# EAGLE design UltrasonicSensorArray (EAGLE 9.5.2)
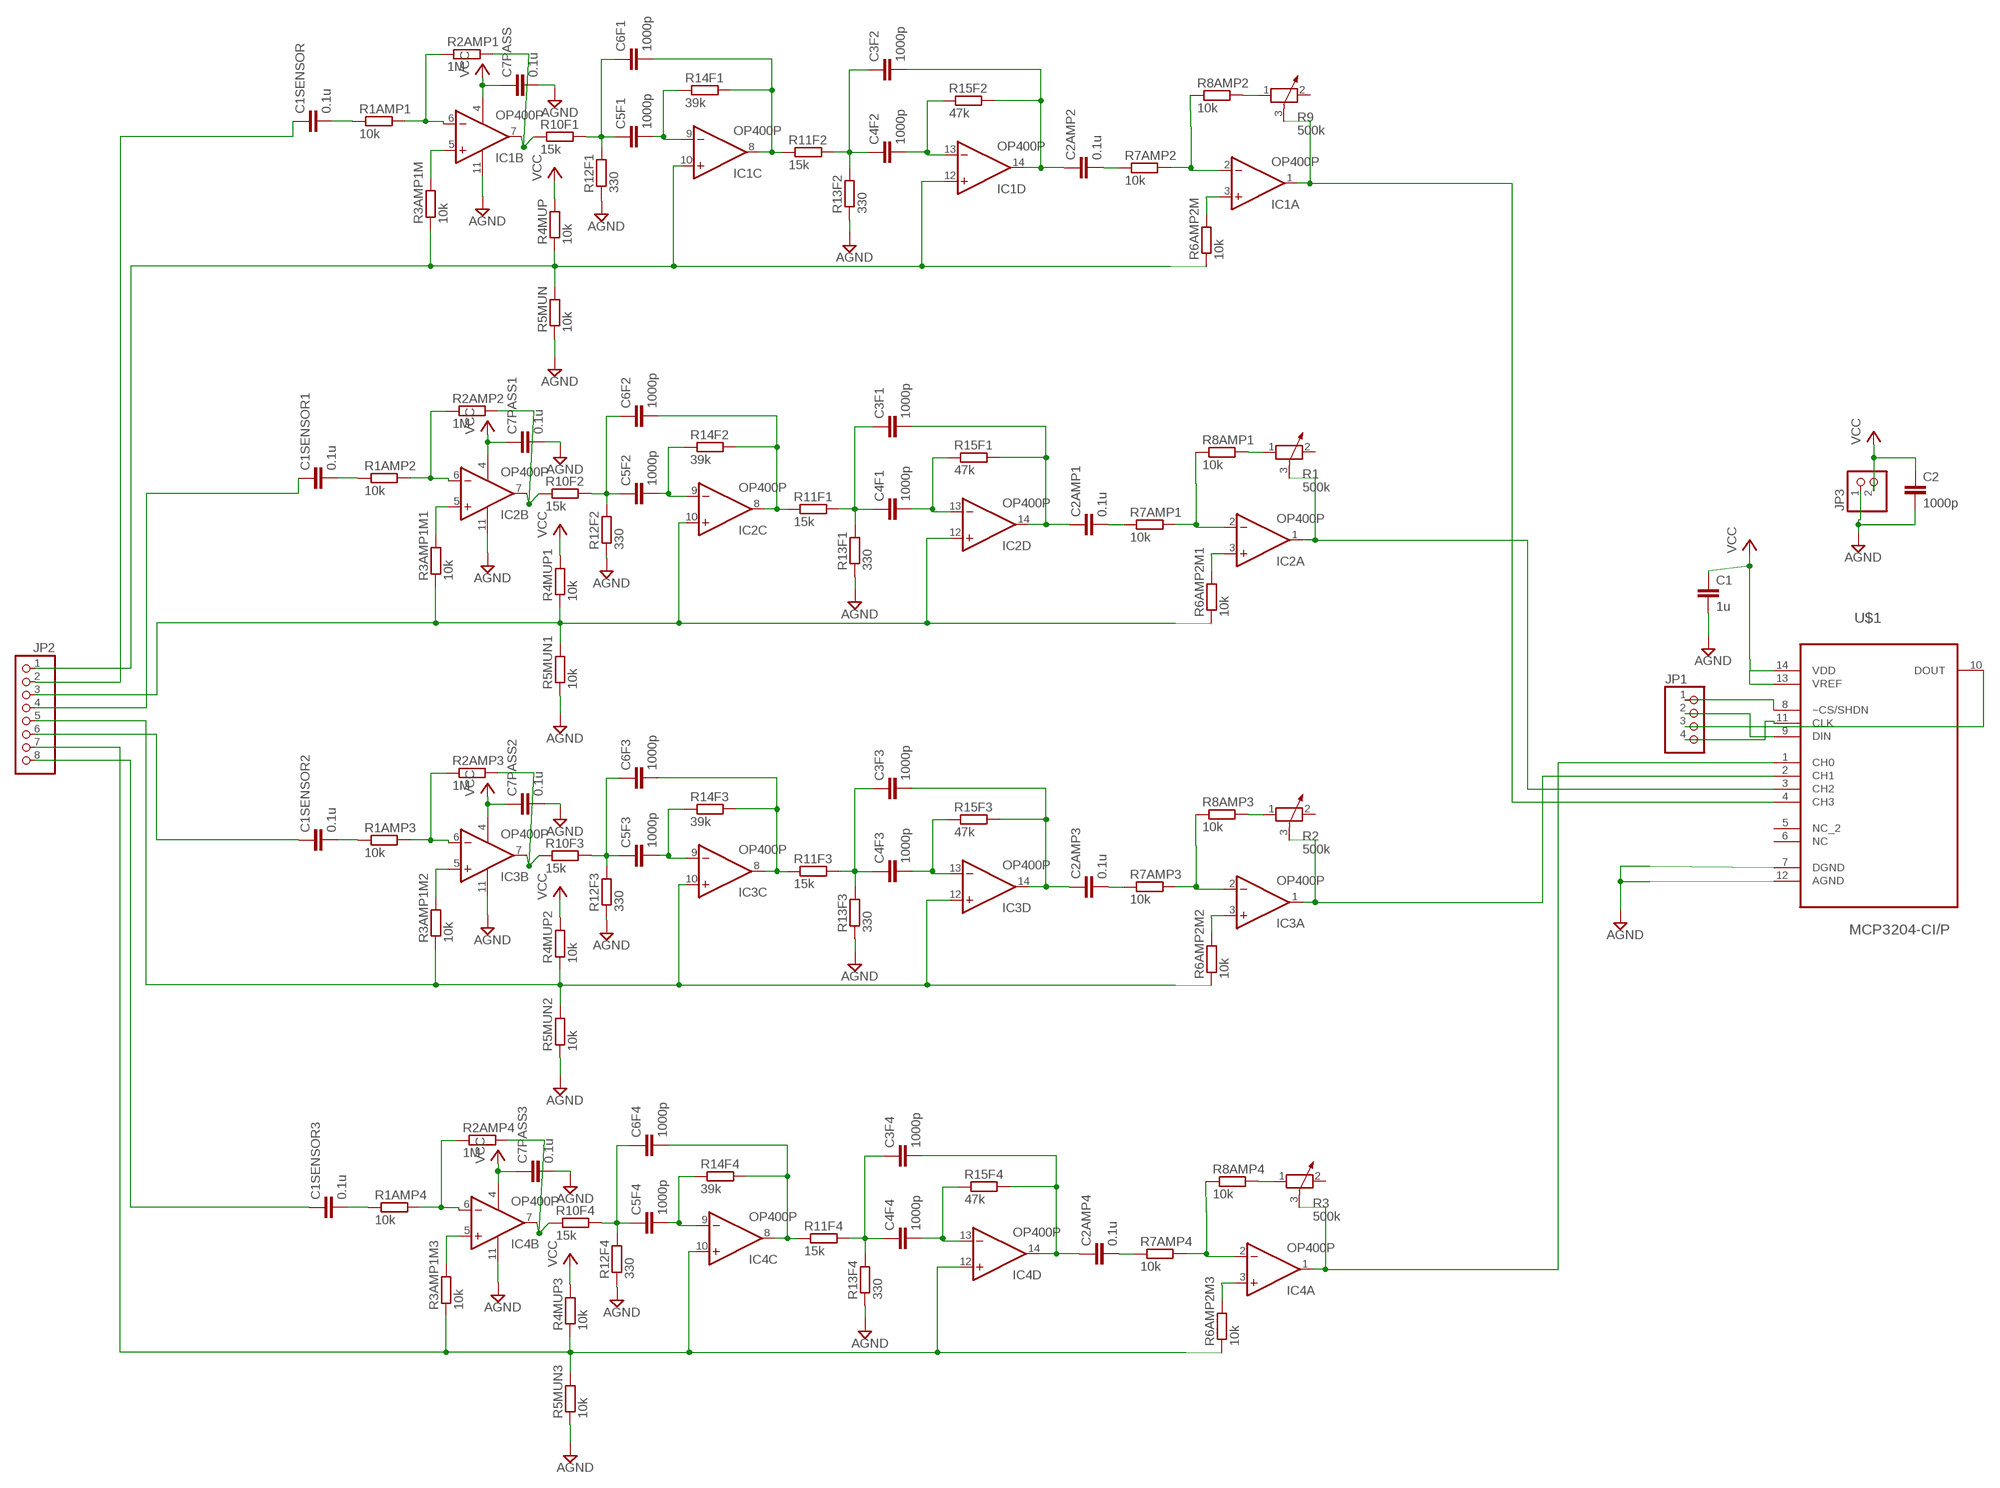
[diagram p0: schematic, sheet 1]

## Parts
C1  1u  C-EUC0603K  [C0603K]
C1SENSOR  0.1u  C-EUC0603K  [C0603K]
C1SENSOR1  0.1u  C-EUC0603K  [C0603K]
C1SENSOR2  0.1u  C-EUC0603K  [C0603K]
C1SENSOR3  0.1u  C-EUC0603K  [C0603K]
C2  1000p  C-EUC0603K  [C0603K]
C2AMP1  0.1u  C-EUC0603K  [C0603K]
C2AMP2  0.1u  C-EUC0603K  [C0603K]
C2AMP3  0.1u  C-EUC0603K  [C0603K]
C2AMP4  0.1u  C-EUC0603K  [C0603K]
C3F1  1000p  C-EUC0603K  [C0603K]
C3F2  1000p  C-EUC0603K  [C0603K]
C3F3  1000p  C-EUC0603K  [C0603K]
C3F4  1000p  C-EUC0603K  [C0603K]
C4F1  1000p  C-EUC0603K  [C0603K]
C4F2  1000p  C-EUC0603K  [C0603K]
C4F3  1000p  C-EUC0603K  [C0603K]
C4F4  1000p  C-EUC0603K  [C0603K]
C5F1  1000p  C-EUC0603K  [C0603K]
C5F2  1000p  C-EUC0603K  [C0603K]
C5F3  1000p  C-EUC0603K  [C0603K]
C5F4  1000p  C-EUC0603K  [C0603K]
C6F1  1000p  C-EUC0603K  [C0603K]
C6F2  1000p  C-EUC0603K  [C0603K]
C6F3  1000p  C-EUC0603K  [C0603K]
C6F4  1000p  C-EUC0603K  [C0603K]
C7PASS  0.1u  C-EUC0603K  [C0603K]
C7PASS1  0.1u  C-EUC0603K  [C0603K]
C7PASS2  0.1u  C-EUC0603K  [C0603K]
C7PASS3  0.1u  C-EUC0603K  [C0603K]
IC1  OP400P  [DIL14]
IC2  OP400P  [DIL14]
IC3  OP400P  [DIL14]
IC4  OP400P  [DIL14]
JP1  PINHD-1X4  [1X04]
JP2  PINHD-1X8  [1X08]
JP3  PINHD-1X2  [1X02]
R1  500k  POTENTIOMETER_PT-10  [PT-10]
R1AMP1  10k  R-EU_R0603  [R0603]
R1AMP2  10k  R-EU_R0603  [R0603]
R1AMP3  10k  R-EU_R0603  [R0603]
R1AMP4  10k  R-EU_R0603  [R0603]
R2  500k  POTENTIOMETER_PT-10  [PT-10]
R2AMP1  1M  R-EU_R0603  [R0603]
R2AMP2  1M  R-EU_R0603  [R0603]
R2AMP3  1M  R-EU_R0603  [R0603]
R2AMP4  1M  R-EU_R0603  [R0603]
R3  500k  POTENTIOMETER_PT-10  [PT-10]
R3AMP1M  10k  R-EU_R0603  [R0603]
R3AMP1M1  10k  R-EU_R0603  [R0603]
R3AMP1M2  10k  R-EU_R0603  [R0603]
R3AMP1M3  10k  R-EU_R0603  [R0603]
R4MUP  10k  R-EU_R0603  [R0603]
R4MUP1  10k  R-EU_R0603  [R0603]
R4MUP2  10k  R-EU_R0603  [R0603]
R4MUP3  10k  R-EU_R0603  [R0603]
R5MUN  10k  R-EU_R0603  [R0603]
R5MUN1  10k  R-EU_R0603  [R0603]
R5MUN2  10k  R-EU_R0603  [R0603]
R5MUN3  10k  R-EU_R0603  [R0603]
R6AMP2M  10k  R-EU_R0603  [R0603]
R6AMP2M1  10k  R-EU_R0603  [R0603]
R6AMP2M2  10k  R-EU_R0603  [R0603]
R6AMP2M3  10k  R-EU_R0603  [R0603]
R7AMP1  10k  R-EU_R0603  [R0603]
R7AMP2  10k  R-EU_R0603  [R0603]
R7AMP3  10k  R-EU_R0603  [R0603]
R7AMP4  10k  R-EU_R0603  [R0603]
R8AMP1  10k  R-EU_R0603  [R0603]
R8AMP2  10k  R-EU_R0603  [R0603]
R8AMP3  10k  R-EU_R0603  [R0603]
R8AMP4  10k  R-EU_R0603  [R0603]
R9  500k  POTENTIOMETER_PT-10  [PT-10]
R10F1  15k  R-EU_R0603  [R0603]
R10F2  15k  R-EU_R0603  [R0603]
R10F3  15k  R-EU_R0603  [R0603]
R10F4  15k  R-EU_R0603  [R0603]
R11F1  15k  R-EU_R0603  [R0603]
R11F2  15k  R-EU_R0603  [R0603]
R11F3  15k  R-EU_R0603  [R0603]
R11F4  15k  R-EU_R0603  [R0603]
R12F1  330  R-EU_R0603  [R0603]
R12F2  330  R-EU_R0603  [R0603]
R12F3  330  R-EU_R0603  [R0603]
R12F4  330  R-EU_R0603  [R0603]
R13F1  330  R-EU_R0603  [R0603]
R13F2  330  R-EU_R0603  [R0603]
R13F3  330  R-EU_R0603  [R0603]
R13F4  330  R-EU_R0603  [R0603]
R14F1  39k  R-EU_0207/7  [0207/7]
R14F2  39k  R-EU_0207/7  [0207/7]
R14F3  39k  R-EU_0207/7  [0207/7]
R14F4  39k  R-EU_0207/7  [0207/7]
R15F1  47k  R-EU_0207/7  [0207/7]
R15F2  47k  R-EU_0207/7  [0207/7]
R15F3  47k  R-EU_0207/7  [0207/7]
R15F4  47k  R-EU_0207/7  [0207/7]
U$1  MCP3204-CI/P  [DIP254P762X432-14]

## Nets
AGND [power]: C1.2 C2.2 C7PASS1.2 C7PASS2.2 C7PASS3.2 C7PASS.2 IC1.11(P:V-) IC2.11(P:V-) IC3.11(P:V-) IC4.11(P:V-) JP3.1 R5MUN1.1 R5MUN2.1 R5MUN3.1 R5MUN.1 R12F1.1 R12F2.1 R12F3.1 R12F4.1 R13F1.1 R13F2.1 R13F3.1 R13F4.1 U$1.7(DGND) U$1.12(AGND)
N$1: IC1.6(B:-IN) R1AMP1.2 R2AMP1.1
N$2: IC1.5(B:+IN) R3AMP1M.2
N$3: IC1.7(B:OUT) R2AMP1.2 R10F1.1
N$4: IC1.2(A:-IN) R7AMP2.2 R8AMP2.1
N$5: IC1.10(C:+IN) IC1.12(D:+IN) JP2.1 R3AMP1M.1 R4MUP.1 R5MUN.2 R6AMP2M.1
N$6: C1SENSOR.1 JP2.2
N$7: IC1.3(A:+IN) R6AMP2M.2
N$8: C1SENSOR.2 R1AMP1.1
N$9: C2AMP2.2 R7AMP2.1
N$10: R8AMP2.2 R9.1
N$11: IC1.1(A:OUT) R9.3 U$1.4(CH3)
N$12: C2AMP2.1 C3F2.2 IC1.14(D:OUT) R15F2.2
N$13: C5F1.2 IC1.9(C:-IN) R14F1.1
N$14: C4F2.2 IC1.13(D:-IN) R15F2.1
N$15: C3F2.1 C4F2.1 R11F2.2 R13F2.2
N$16: C6F1.2 IC1.8(C:OUT) R11F2.1 R14F1.2
N$17: C5F1.1 C6F1.1 R10F1.2 R12F1.2
N$18: IC2.6(B:-IN) R1AMP2.2 R2AMP2.1
N$19: IC2.7(B:OUT) R2AMP2.2 R10F2.1
N$20: IC2.10(C:+IN) IC2.12(D:+IN) JP2.3 R3AMP1M1.1 R4MUP1.1 R5MUN1.2 R6AMP2M1.1
N$21: IC2.2(A:-IN) R7AMP1.2 R8AMP1.1
N$22: IC2.3(A:+IN) R6AMP2M1.2
N$23: C1SENSOR1.2 R1AMP2.1
N$24: C2AMP1.2 R7AMP1.1
N$25: R1.1 R8AMP1.2
N$26: C2AMP1.1 C3F1.2 IC2.14(D:OUT) R15F1.2
N$27: C5F2.2 IC2.9(C:-IN) R14F2.1
N$28: C4F1.2 IC2.13(D:-IN) R15F1.1
N$29: C3F1.1 C4F1.1 R11F1.2 R13F1.2
N$30: C6F2.2 IC2.8(C:OUT) R11F1.1 R14F2.2
N$31: C5F2.1 C6F2.1 R10F2.2 R12F2.2
N$32: IC2.5(B:+IN) R3AMP1M1.2
N$33: C1SENSOR1.1 JP2.4
N$34: IC2.1(A:OUT) R1.3 U$1.3(CH2)
N$35: IC3.6(B:-IN) R1AMP3.2 R2AMP3.1
N$36: IC3.7(B:OUT) R2AMP3.2 R10F3.1
N$37: IC3.10(C:+IN) IC3.12(D:+IN) JP2.5 R3AMP1M2.1 R4MUP2.1 R5MUN2.2 R6AMP2M2.1
N$38: IC3.2(A:-IN) R7AMP3.2 R8AMP3.1
N$39: IC3.3(A:+IN) R6AMP2M2.2
N$40: C1SENSOR2.2 R1AMP3.1
N$41: C2AMP3.2 R7AMP3.1
N$42: R2.1 R8AMP3.2
N$43: C2AMP3.1 C3F3.2 IC3.14(D:OUT) R15F3.2
N$44: C5F3.2 IC3.9(C:-IN) R14F3.1
N$45: C4F3.2 IC3.13(D:-IN) R15F3.1
N$46: C3F3.1 C4F3.1 R11F3.2 R13F3.2
N$47: C6F3.2 IC3.8(C:OUT) R11F3.1 R14F3.2
N$48: C5F3.1 C6F3.1 R10F3.2 R12F3.2
N$49: IC3.5(B:+IN) R3AMP1M2.2
N$50: C1SENSOR2.1 JP2.6
N$51: IC3.1(A:OUT) R2.3 U$1.2(CH1)
N$52: IC4.6(B:-IN) R1AMP4.2 R2AMP4.1
N$53: IC4.7(B:OUT) R2AMP4.2 R10F4.1
N$54: IC4.10(C:+IN) IC4.12(D:+IN) JP2.7 R3AMP1M3.1 R4MUP3.1 R5MUN3.2 R6AMP2M3.1
N$55: IC4.2(A:-IN) R7AMP4.2 R8AMP4.1
N$56: IC4.3(A:+IN) R6AMP2M3.2
N$57: C1SENSOR3.2 R1AMP4.1
N$58: C2AMP4.2 R7AMP4.1
N$59: R3.1 R8AMP4.2
N$60: C2AMP4.1 C3F4.2 IC4.14(D:OUT) R15F4.2
N$61: C5F4.2 IC4.9(C:-IN) R14F4.1
N$62: C4F4.2 IC4.13(D:-IN) R15F4.1
N$63: C3F4.1 C4F4.1 R11F4.2 R13F4.2
N$64: C6F4.2 IC4.8(C:OUT) R11F4.1 R14F4.2
N$65: C5F4.1 C6F4.1 R10F4.2 R12F4.2
N$66: IC4.5(B:+IN) R3AMP1M3.2
N$67: C1SENSOR3.1 JP2.8
N$68: IC4.1(A:OUT) R3.3 U$1.1(CH0)
N$69: JP1.1 U$1.8(~CS/SHDN)
N$70: JP1.2 U$1.9(DIN)
N$71: JP1.4 U$1.11(CLK)
N$72: JP1.3 U$1.10(DOUT)
VCC [power]: C1.1 C2.1 C7PASS1.1 C7PASS2.1 C7PASS3.1 C7PASS.1 IC1.4(P:V+) IC2.4(P:V+) IC3.4(P:V+) IC4.4(P:V+) JP3.2 R4MUP1.2 R4MUP2.2 R4MUP3.2 R4MUP.2 U$1.13(VREF) U$1.14(VDD)
Unconnected: R1.2 R2.2 R3.2 R9.2 U$1.5(NC_2) U$1.6(NC)

## Library data of the parts
C1 C1SENSOR C1SENSOR1-C1SENSOR3 C2 C2AMP1-C2AMP4 C3F1-C3F4 C4F1-C4F4 C5F1-C5F4 C6F1-C6F4 C7PASS C7PASS1-C7PASS3 = rcl:C-EU: CAPACITOR, European symbol; SPICEPREFIX: C
IC1-IC4 = linear:OP400: OP AMP
JP1 = pinhead:PINHD-1X4: PIN HEADER
JP2 = pinhead:PINHD-1X8: PIN HEADER
JP3 = pinhead:PINHD-1X2: PIN HEADER
R1-R3 R9 = rcl:POTENTIOMETER_: Potentiometer; SPICEMODEL: POT; SPICEPREFIX: X
R1AMP1-R1AMP4 R2AMP1-R2AMP4 R3AMP1M R3AMP1M1-R3AMP1M3 R4MUP R4MUP1-R4MUP3 R5MUN R5MUN1-R5MUN3 R6AMP2M R6AMP2M1-R6AMP2M3 R7AMP1-R7AMP4 R8AMP1-R8AMP4 R10F1-R10F4 R11F1-R11F4 R12F1-R12F4 R13F1-R13F4 R14F1-R14F4 R15F1-R15F4 = rcl:R-EU_: RESISTOR, European symbol; SPICEPREFIX: R
U$1 = MCP3204-CI_P:MCP3204-CI/P: A/D Converters; AVAILABILITY: Unavailable; DESCRIPTION: 12 Bit Analog to Digital Converter 2, 4 Input 1 SAR 14-PDIP; MF: Microchip; MP: MCP3204-CI/P; PACKAGE: DIP-14 Microchip; PRICE: None

## Net classes
0 default: width 0.61 mm, clearance 0.203 mm
1 power: width 0.914 mm, clearance 0.254 mm

## Board
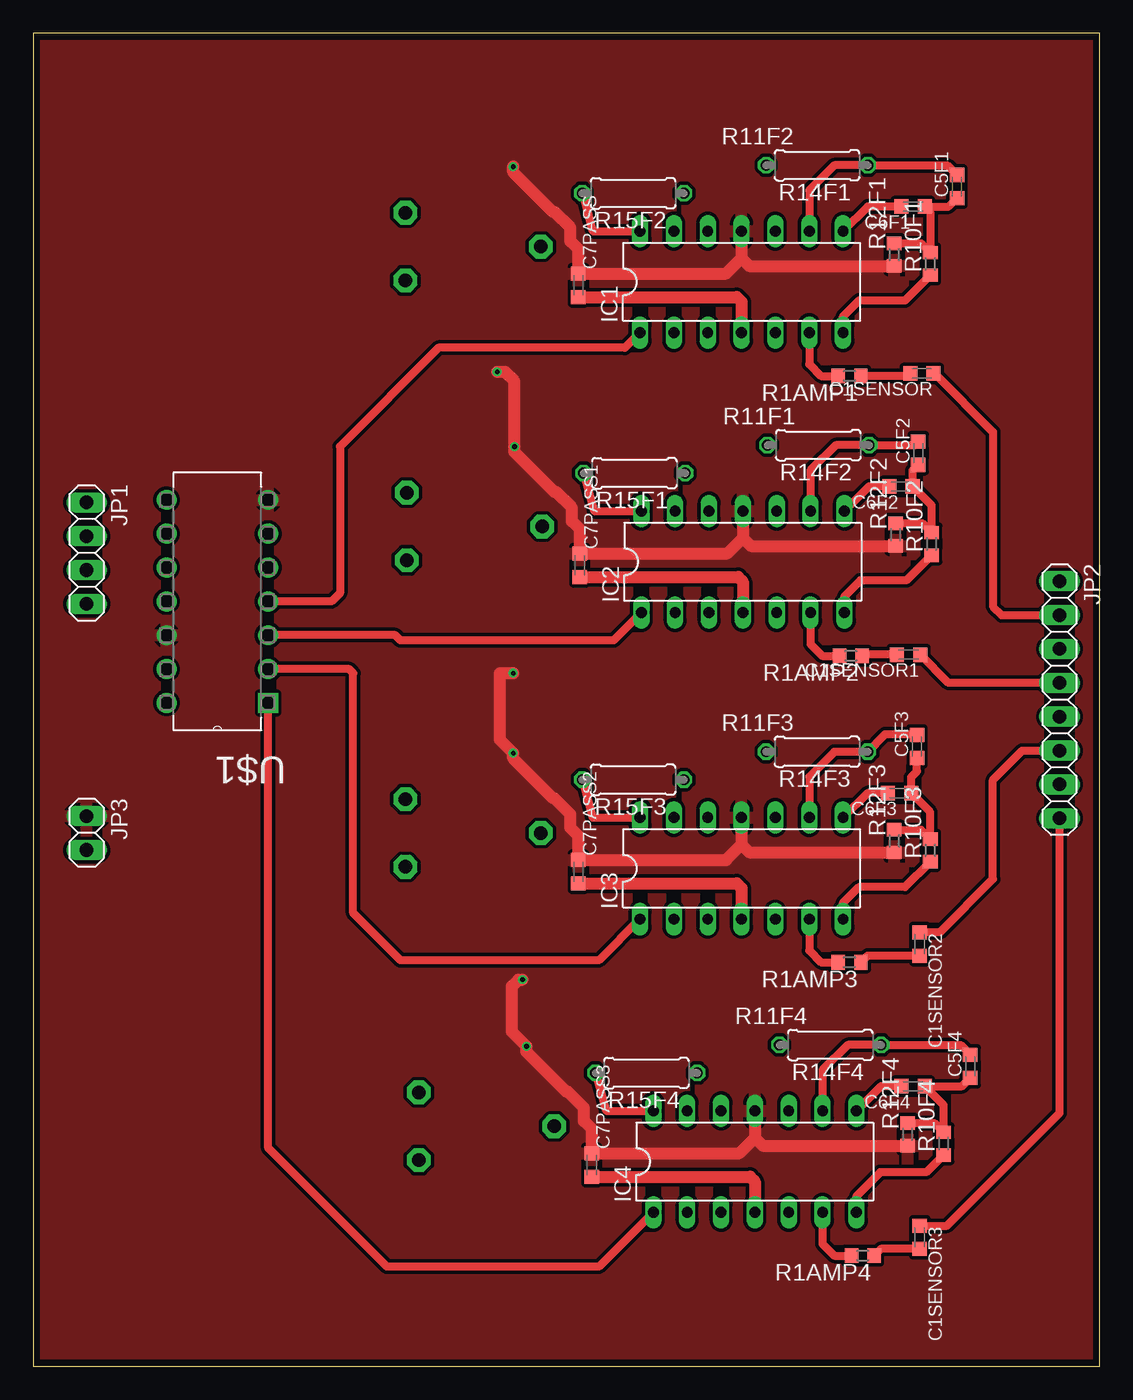
[diagram p1: board, top side]
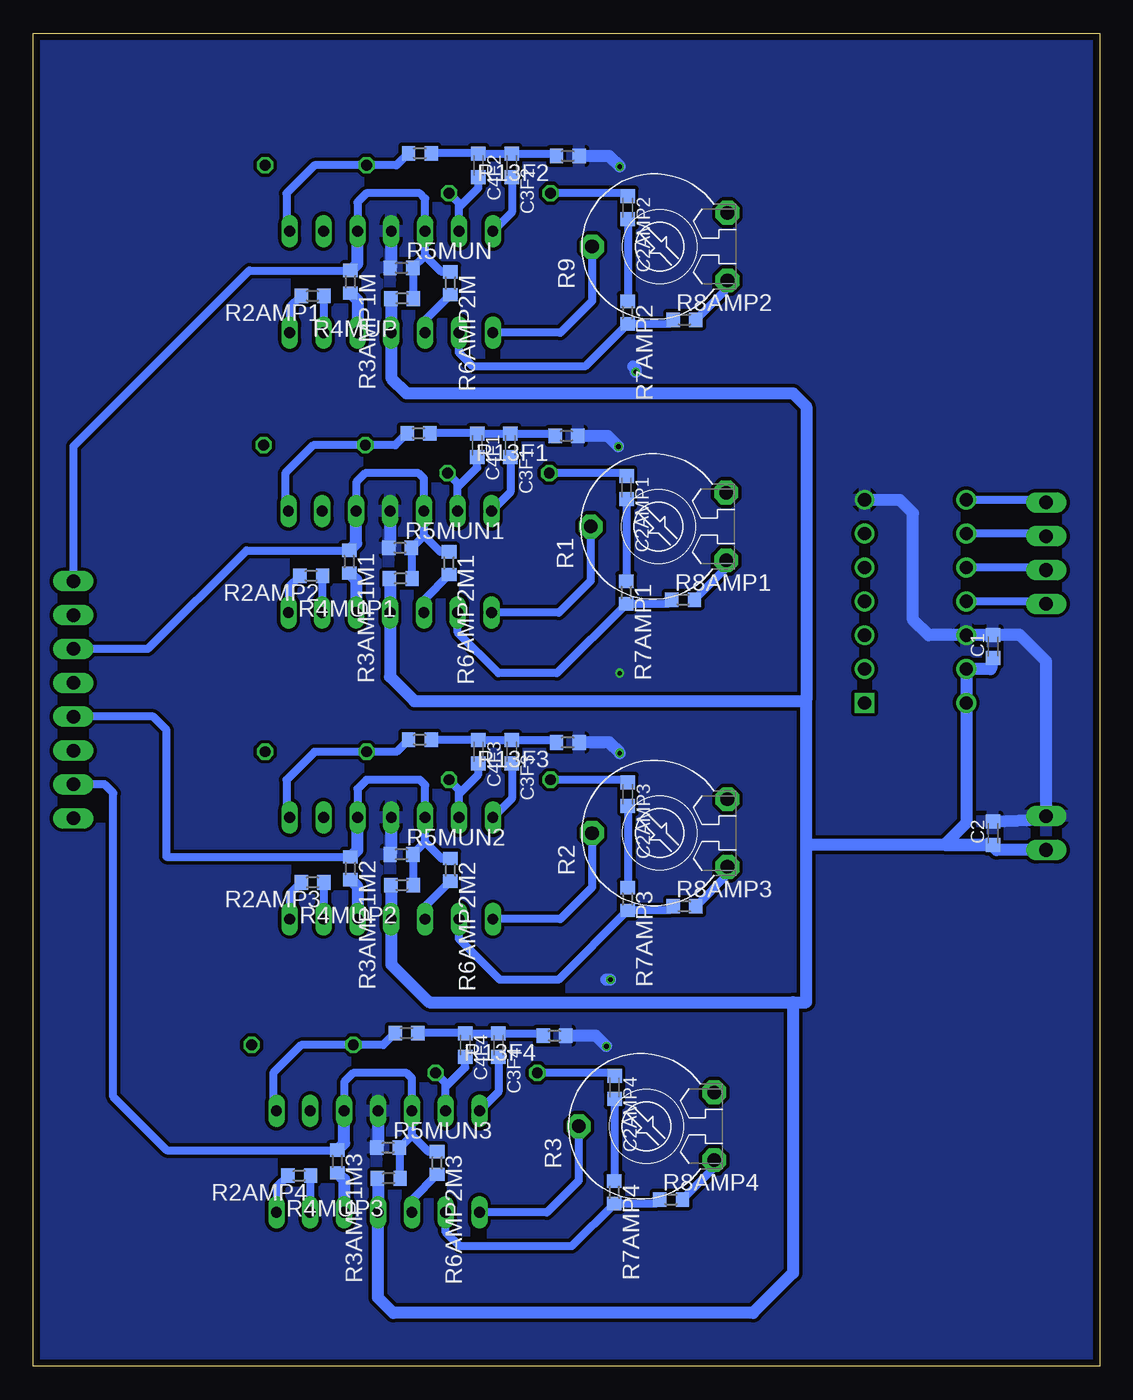
[diagram p2: board, bottom side, seen from below]

Size 80 x 100 mm. Coordinates in mm from the lower left corner, seen from the top.
Outline: 0,0 80,0 80,100 0,100 0,0
Copper layers (1*16): Top 0.035mm / dielectric 1.6mm / Bottom 0.035mm
Design rules "Elecrow_2-layer_PCB_eagle_rule": minimum track width 6mil, minimum drill 12mil, track to track 6mil, track to pad 6mil, pad to pad 6mil, via to via 8mil, smd to smd 0mil, copper to edge 20mil, drill to drill 10mil, minimum pad ring 6mil, minimum via ring 6mil, stop-mask expansion 0mil, vias tented up to drill 100mil, thermal gap 10mil

### Footprints (pad centres in the part's own frame; a part is rotated, then mirrored left to right if it is on the bottom)
C0603K = smd 1.05 x 1.08: 1 -0.875,0; 2 0.875,0
DIL14 = drill 0.813 long: 1 -7.62,-3.81; 2 -5.08,-3.81; 3 -2.54,-3.81; 4 0,-3.81; 5 2.54,-3.81; 6 5.08,-3.81; 7 7.62,-3.81; 8 7.62,3.81; 9 5.08,3.81; 10 2.54,3.81; 11 0,3.81; 12 -2.54,3.81; 13 -5.08,3.81; 14 -7.62,3.81
1X04 = drill 1.016 long: 1 -3.81,0; 2 -1.27,0; 3 1.27,0; 4 3.81,0
1X08 = drill 1.016 long: 1 -8.89,0; 2 -6.35,0; 3 -3.81,0; 4 -1.27,0; 5 1.27,0; 6 3.81,0; 7 6.35,0; 8 8.89,0
1X02 = drill 1.016 long: 1 -1.27,0; 2 1.27,0
PT-10 = drill 1.016 pad 1.778 octagon: 1 -2.54,-5.08; 2 2.54,-5.08; 3 0,5.08
R0603 = smd 1 x 1.1: 1 -0.85,0; 2 0.85,0
0207/7 = drill 0.813 octagon: 1 -3.81,0; 2 3.81,0
DIP254P762X432-14 = drill 0.991 square: 1 -7.62,15.24 | drill 0.991: 2 -7.62,12.7; 3 -7.62,10.16; 4 -7.62,7.62; 5 -7.62,5.08; 6 -7.62,2.54; 7 -7.62,0; 8 0,0; 9 0,2.54; 10 0,5.08; 11 0,7.62; 12 0,10.16; 13 0,12.7; 14 0,15.24

### Placement (x,y rotation side)
C1  8,54 90 bottom
C1SENSOR  66.67,74.49 180 top
C1SENSOR1  65.67,53.39 180 top
C1SENSOR2  66.51,31.67 270 top
C1SENSOR3  66.51,9.67 270 top
C2  8,40 90 bottom
C2AMP1  35.49,65.92 270 bottom
C2AMP2  35.39,86.92 270 bottom
C2AMP3  35.39,42.92 270 bottom
C2AMP4  36.39,20.92 270 bottom
C3F1  44.2,69.1 270 bottom
C3F2  44.1,90.1 270 bottom
C3F3  44.1,46.1 270 bottom
C3F4  45.1,24.1 270 bottom
C4F1  46.7,69.1 270 bottom
C4F2  46.6,90.1 270 bottom
C4F3  46.6,46.1 270 bottom
C4F4  47.6,24.1 270 bottom
C5F1  69.3,88.5 90 top
C5F2  66.4,68.5 90 top
C5F3  66.3,46.5 90 top
C5F4  70.3,22.5 90 top
C6F1  66,87 180 top
C6F2  65.1,66 180 top
C6F3  65,43 180 top
C6F4  66,21 180 top
C7PASS  40.9,81.1 90 top
C7PASS1  41,60.1 90 top
C7PASS2  40.9,37.1 90 top
C7PASS3  41.9,15.1 90 top
IC1  53.14,81.35 0 top
IC2  53.24,60.35 0 top
IC3  53.14,37.35 0 top
IC4  54.14,15.35 0 top
JP1  4,61 270 top
JP2  77,50 270 top
JP3  4,40 270 top
R1  33.1,63 90 bottom
R1AMP1  61.24,74.3 180 top
R1AMP2  61.34,53.3 180 top
R1AMP3  61.24,30.3 180 top
R1AMP4  62.24,8.3 180 top
R2  33,40 90 bottom
R2AMP1  59.05,80.3 180 bottom
R2AMP2  59.15,59.3 180 bottom
R2AMP3  59.05,36.3 180 bottom
R2AMP4  60.05,14.3 180 bottom
R3  34,18 90 bottom
R3AMP1M  56.2,81.36 270 bottom
R3AMP1M1  56.3,60.36 270 bottom
R3AMP1M2  56.2,37.36 270 bottom
R3AMP1M3  57.2,15.36 270 bottom
R4MUP  52.33,80.1 180 bottom
R4MUP1  52.43,59.1 180 bottom
R4MUP2  52.33,36.1 180 bottom
R4MUP3  53.33,14.1 180 bottom
R5MUN  52.38,82.4 0 bottom
R5MUN1  52.48,61.4 0 bottom
R5MUN2  52.38,38.4 0 bottom
R5MUN3  53.38,16.4 0 bottom
R6AMP2M  48.71,81.24 270 bottom
R6AMP2M1  48.81,60.24 270 bottom
R6AMP2M2  48.71,37.24 270 bottom
R6AMP2M3  49.71,15.24 270 bottom
R7AMP1  35.51,58.05 270 bottom
R7AMP2  35.41,79.05 270 bottom
R7AMP3  35.41,35.05 270 bottom
R7AMP4  36.41,13.05 270 bottom
R8AMP1  31.24,57.51 0 bottom
R8AMP2  31.14,78.51 0 bottom
R8AMP3  31.14,34.51 0 bottom
R8AMP4  32.14,12.51 0 bottom
R9  33,84 90 bottom
R10F1  67.3,82.7 90 top
R10F2  67.4,61.7 90 top
R10F3  67.3,38.7 90 top
R10F4  68.3,16.7 90 top
R11F1  51.1,70 0 bottom
R11F2  51,91 0 bottom
R11F3  51,47 0 bottom
R11F4  52,25 0 bottom
R12F1  64.6,83.4 90 top
R12F2  64.7,62.4 90 top
R12F3  64.6,39.4 90 top
R12F4  65.6,17.4 90 top
R13F1  40,69.8 180 bottom
R13F2  39.9,90.8 180 bottom
R13F3  39.9,46.8 180 bottom
R13F4  40.9,24.8 180 bottom
R14F1  58.8,90.1 180 top
R14F2  58.9,69.1 180 top
R14F3  58.8,46.1 180 top
R14F4  59.8,24.1 180 top
R15F1  45.1,67 180 top
R15F2  45,88 180 top
R15F3  45,44 180 top
R15F4  46,22 180 top
U$1  10,65 180 top

### Tracks (layer width: path | path; a pad name or v marks a point on that pad's centre or on a via)
AGND  (via drill 0.35)
  Top 0.914: 53.14,83.14 51.98,81.97 C7PASS.2 40.9,83.8 40.3,84.4 40.3,85.4 39.1,86.6 39,86.6 36,89.6 v36,90 | IC1.11 53.14,83.14 | 53.14,83.14 53.73,82.55 R12F1.1 | 54.14,17.14 52.98,15.97 C7PASS3.2 41.9,17.8 41.3,18.4 41.3,19.4 40.1,20.6 40,20.6 37,23.6 v37,24 35.9,25.1 35.9,28.5 36.4,29 v36.7,29 | IC4.11 54.14,17.14 | 54.14,17.14 54.73,16.55 R12F4.1 | 53.14,39.14 51.98,37.98 C7PASS2.2 40.9,39.8 40.3,40.4 40.3,41.4 39.1,42.6 39,42.6 36,45.6 v36,46 35,47 35,52 v36,52 | IC3.11 53.14,39.14 | 53.14,39.14 53.73,38.55 R12F3.1 | 53.24,62.14 52.08,60.98 C7PASS1.2 41,62.8 40.4,63.4 40.4,64.4 39.2,65.6 39.1,65.6 36.1,68.6 v36.1,69 36.1,73.9 35.4,74.6 v34.8,74.6 | IC2.11 53.24,62.14 | 53.24,62.14 53.83,61.55 R12F2.1
  Bottom 0.914: IC1.11 53.14,82.49 R5MUN.1 | v36,90 36.8,90.8 R13F2.1 | R5MUN3.1 54.14,16.49 IC4.11 | v37,24 37.8,24.8 R13F4.1 | IC3.11 53.14,38.49 R5MUN2.1 | v36,46 36.8,46.8 R13F3.1 | IC2.11 53.24,61.49 R5MUN1.1 | v36.1,69 36.9,69.8 R13F1.1 | C2.2 4.25,41.02 JP3.1 4,52.88 6,54.88 C1.2 8.04,54.84 U$1.12 12.84,54.84 14,56 14,64 15,65 U$1.7 | v34.8,74.6 34.8,74.8 35,75 | v36.7,29 37,29
  pour Bottom: 0,100 0,0 80,0 80,100
  pour Top: 0,100 0,0 80,0 80,100
N$1
  Top 0.61: IC1.6 58.22,75.18 59.1,74.3 R1AMP1.2
  Bottom 0.61: IC1.6 58.2,77.56 R2AMP1.1
N$2
  Bottom 0.914: R3AMP1M.2 55.68,79.99 IC1.5
N$3
  Top 0.61: IC1.7 60.76,78.76 61.95,79.95 65.4,79.95 R10F1.1
  Bottom 0.61: R2AMP1.2 60.76,79.44 IC1.7
N$4
  Bottom 0.61: R8AMP2.1 32.3,78.2 R7AMP2.2 38.61,75 47,75 48.06,76.06 IC1.2
N$5
  Bottom 0.61: 50.6,83.33 R5MUN.2 51.48,82.35 R4MUP.1 | 50.6,83.33 IC1.12 50.6,87.6 51,88 55,88 55.68,87.32 IC1.10 | R6AMP2M.1 49.36,82.09 50.6,83.33 | R3AMP1M.1 63.79,82.21 77,69 JP2.1
  Bottom 0.914: R3AMP1M.1 55.68,82.73 IC1.10
N$6
  Top 0.61: C1SENSOR.1 67.6,74.49 72,70.09 72,57 72.65,56.35 JP2.2
N$7
  Bottom 0.61: R6AMP2M.2 50.6,78.5 IC1.3
N$8
  Top 0.61: C1SENSOR.2 65.61,74.3 R1AMP1.1
N$9
  Bottom 0.61: C2AMP2.2 35.39,79.92 R7AMP2.1
N$10
  Bottom 0.61: R9.1 27.92,80.88 R8AMP2.2
N$11
  Top 0.61: U$1.4 22.38,57.38 23,58 23,69 30.4,76.4 44.38,76.4 IC1.1
  Bottom 0.61: R9.3 38.08,79.92 40.46,77.54 IC1.1
N$12
  Top 0.61: R15F2.2 41.97,85.16 IC1.14
  Bottom 0.61: C3F2.2 44.1,86.58 IC1.14 | C2AMP2.1 35.59,88 R15F2.2
N$13
  Top 0.61: C5F1.2 68.58,90.1 R14F1.1 60.1,90.1 58.22,88.22 IC1.9
N$14
  Bottom 0.61: C4F2.2 46.6,88.4 48.06,86.94 IC1.13 48.06,87.25 R15F2.1
N$15
  Bottom 0.61: R11F2.2 46.62,91 C4F2.1 C3F2.1 40.92,90.97 R13F2.2
N$16
  Top 0.61: C6F1.2 62.6,87 IC1.8
  Bottom 0.61: IC1.8 61,85.4 61,88 58.9,90.1 R14F1.2 52.75,90.1 R11F2.1
N$17
  Top 0.61: C5F1.1 68.67,87 C6F1.1 67.3,86.58 R10F1.2 66.6,84.25 R12F1.2
N$18
  Top 0.61: IC2.6 58.32,54.18 59.2,53.3 R1AMP2.2
  Bottom 0.61: IC2.6 58.3,56.56 R2AMP2.1
N$19
  Top 0.61: IC2.7 60.86,57.76 62.05,58.95 65.5,58.95 R10F2.1
  Bottom 0.61: R2AMP2.2 60.86,58.44 IC2.7
N$20
  Bottom 0.61: 50.7,62.33 R5MUN1.2 51.58,61.35 R4MUP1.1 | 50.7,62.33 IC2.12 50.7,66.6 51.1,67 55.1,67 55.78,66.32 IC2.10 | R6AMP2M1.1 49.46,61.09 50.7,62.33 | R3AMP1M1.1 64,61.21 71.4,53.81 JP2.3
  Bottom 0.914: R3AMP1M1.1 55.78,61.73 IC2.10
N$21
  Bottom 0.61: R8AMP1.1 32.4,57.2 R7AMP1.2 40.71,52 45.1,52 48.16,55.06 IC2.2
N$22
  Bottom 0.61: R6AMP2M1.2 50.7,57.5 IC2.3
N$23
  Top 0.61: R1AMP2.1 62.28,53.39 C1SENSOR1.2
N$24
  Bottom 0.61: C2AMP1.2 35.49,58.92 R7AMP1.1
N$25
  Bottom 0.61: R1.1 28.02,59.88 R8AMP1.2
N$26
  Top 0.61: R15F1.2 42.07,64.16 IC2.14
  Bottom 0.61: C3F1.2 44.2,65.58 IC2.14 | C2AMP1.1 35.7,67 R15F1.2
N$27
  Top 0.61: C5F2.2 66.12,69.1 R14F2.1 60.2,69.1 58.32,67.22 IC2.9
N$28
  Bottom 0.61: C4F1.2 46.7,67.4 48.16,65.94 IC2.13 48.16,66.25 R15F1.1
N$29
  Bottom 0.61: R11F1.2 46.73,70 C4F1.1 C3F1.1 41.02,69.97 R13F1.2
N$30
  Top 0.61: C6F2.2 62.7,66 IC2.8
  Bottom 0.61: IC2.8 61.1,64.4 61.1,67 59,69.1 R14F2.2 52.85,69.1 R11F1.1
N$31
  Top 0.61: C5F2.1 65.97,67.2 C6F2.1 67.4,64.58 R10F2.2 66.7,63.25 R12F2.2
N$32
  Bottom 0.914: R3AMP1M1.2 55.78,58.99 IC2.5
N$33
  Top 0.61: JP2.4 68.67,51.27 C1SENSOR1.1
N$34
  Top 0.61: IC2.1 43.54,54.46 27.54,54.46 27.16,54.84 U$1.3
  Bottom 0.61: R1.3 38.18,58.92 40.56,56.54 IC2.1
N$35
  Top 0.61: IC3.6 58.22,31.18 59.1,30.3 R1AMP3.2
  Bottom 0.61: IC3.6 58.2,33.56 R2AMP3.1
N$36
  Top 0.61: IC3.7 60.76,34.76 61.95,35.95 65.4,35.95 R10F3.1
  Bottom 0.61: R2AMP3.2 60.76,35.44 IC3.7
N$37
  Bottom 0.61: 50.6,39.33 R5MUN2.2 51.48,38.35 R4MUP2.1 | 50.6,39.33 IC3.12 50.6,43.6 51,44 55,44 55.68,43.32 IC3.10 | R6AMP2M2.1 49.36,38.09 50.6,39.33 | R3AMP1M2.1 70,38.21 70,47.73 71,48.73 JP2.5
  Bottom 0.914: R3AMP1M2.1 55.68,38.73 IC3.10
N$38
  Bottom 0.61: R8AMP3.1 32.3,34.2 R7AMP3.2 40.61,29 45,29 48.06,32.06 IC3.2
N$39
  Bottom 0.61: R6AMP2M2.2 50.6,34.5 IC3.3
N$40
  Top 0.61: C1SENSOR2.2 62.59,30.8 R1AMP3.1
N$41
  Bottom 0.61: C2AMP3.2 35.39,35.92 R7AMP3.1
N$42
  Bottom 0.61: R2.1 27.92,36.88 R8AMP3.2
N$43
  Top 0.61: R15F3.2 41.97,41.16 IC3.14
  Bottom 0.61: C3F3.2 44.1,42.58 IC3.14 | C2AMP3.1 35.59,44 R15F3.2
N$44
  Top 0.61: C5F3.2 66.28,47.4 63.91,47.4 R14F3.1 60.1,46.1 58.22,44.22 IC3.9
N$45
  Bottom 0.61: C4F3.2 46.6,44.4 48.06,42.94 IC3.13 48.06,43.25 R15F3.1
N$46
  Bottom 0.61: R11F3.2 46.62,47 C4F3.1 C3F3.1 40.92,46.98 R13F3.2
N$47
  Top 0.61: C6F3.2 62.6,43 IC3.8
  Bottom 0.61: IC3.8 61,41.4 61,44 58.9,46.1 R14F3.2 52.75,46.1 R11F3.1
N$48
  Top 0.61: C5F3.1 66.3,44.62 65.88,44.2 C6F3.1 67.3,41.58 R10F3.2 66.6,40.25 R12F3.2
N$49
  Bottom 0.914: R3AMP1M2.2 55.68,35.99 IC3.5
N$50
  Top 0.61: C1SENSOR2.1 68,32.55 72,36.55 72,44 74.19,46.19 JP2.6
N$51
  Top 0.61: IC3.1 42.44,30.46 27.54,30.46 24,34 24,52 23.7,52.3 U$1.2
  Bottom 0.61: R2.3 38.08,35.92 40.46,33.54 IC3.1
N$52
  Top 0.61: IC4.6 59.22,9.18 60.1,8.3 R1AMP4.2
  Bottom 0.61: IC4.6 59.2,11.56 R2AMP4.1
N$53
  Top 0.61: IC4.7 61.76,12.76 63.55,14.55 67,14.55 R10F4.1
  Bottom 0.61: R2AMP4.2 61.76,13.44 IC4.7
N$54
  Bottom 0.61: 51.6,17.33 R5MUN3.2 52.48,16.35 R4MUP3.1 | 51.6,17.33 IC4.12 51.6,21.6 52,22 56,22 56.68,21.32 IC4.10 | R6AMP2M3.1 50.36,16.09 51.6,17.33 | R3AMP1M3.1 70,16.21 74,20.21 74,43 74.65,43.65 JP2.7
  Bottom 0.914: R3AMP1M3.1 56.68,16.73 IC4.10
N$55
  Bottom 0.61: R8AMP4.1 33.3,12.2 R7AMP4.2 39.61,9 48,9 49.06,10.06 IC4.2
N$56
  Bottom 0.61: R6AMP2M3.2 51.6,12.5 IC4.3
N$57
  Top 0.61: C1SENSOR3.2 63.59,8.79 R1AMP4.1
N$58
  Bottom 0.61: C2AMP4.2 36.39,13.92 R7AMP4.1
N$59
  Bottom 0.61: R3.1 28.92,14.88 R8AMP4.2
N$60
  Top 0.61: R15F4.2 42.97,19.16 IC4.14
  Bottom 0.61: C3F4.2 45.1,20.58 IC4.14 | C2AMP4.1 36.59,22 R15F4.2
N$61
  Top 0.61: C5F4.2 69.58,24.1 R14F4.1 61.1,24.1 59.22,22.22 IC4.9
N$62
  Bottom 0.61: C4F4.2 47.6,22.4 49.06,20.94 IC4.13 49.06,21.25 R15F4.1
N$63
  Bottom 0.61: R11F4.2 47.62,25 C4F4.1 C3F4.1 41.92,24.98 R13F4.2
N$64
  Top 0.61: C6F4.2 63.6,21 IC4.8
  Bottom 0.61: IC4.8 62,19.4 62,22 59.9,24.1 R14F4.2 53.75,24.1 R11F4.1
N$65
  Top 0.61: C5F4.1 69.67,21 C6F4.1 68.3,19.57 R10F4.2 67.6,18.25 R12F4.2
N$66
  Bottom 0.914: R3AMP1M3.2 56.68,13.99 IC4.5
N$67
  Top 0.61: C1SENSOR3.1 68.55,10.54 77,19 JP2.8
N$68
  Top 0.61: IC4.1 42.44,7.46 26.54,7.46 17.62,16.38 U$1.1
  Bottom 0.61: R3.3 39.08,13.92 41.46,11.54 IC4.1
N$69
  Bottom 0.61: JP1.1 4.19,65 U$1.8
N$70
  Bottom 0.61: JP1.2 4.19,62.46 U$1.9
N$71
  Bottom 0.61: JP1.4 4.19,57.38 U$1.11
N$72
  Bottom 0.61: JP1.3 4.19,59.92 U$1.10
VCC
  Top 0.914: C7PASS.1 52.77,80.22 53.14,79.86 IC1.4 | C7PASS3.1 53.77,14.22 54.14,13.86 IC4.4 | C7PASS2.1 52.77,36.23 53.14,35.86 IC3.4 | C7PASS1.1 52.88,59.23 53.24,58.86 IC2.4
  Bottom 0.914: R4MUP.2 53.14,80.06 IC1.4 53.14,74.14 52,73 23,73 22,72 22,50 22.1,49.9 | R4MUP3.2 54.14,14.06 IC4.4 54.14,5.14 53,4 26,4 23,7 23,27.3 | R4MUP2.2 53.14,36.06 IC3.4 53.14,30.14 50.3,27.3 23,27.3 | R4MUP1.2 53.24,59.06 IC2.4 53.24,51.74 51.4,49.9 22.1,49.9 | 22,39.12 22,27.3 23,27.3 | C2.1 11.63,39.12 10,40.76 U$1.14 U$1.13 8.18,52.3 C1.1 | JP3.2 7.73,38.73 8,39 C2.1 | C2.1 22,39.12 | 22,39.12 22,49.8 22.1,49.9